# Altium project Project Kraken (The Ultimate ESP32-S3 dev board).PrjPcb (part 5 of 5)

## Sheet DAC.SchDoc
size A3; SheetNumber: 9; SheetTotal: 9
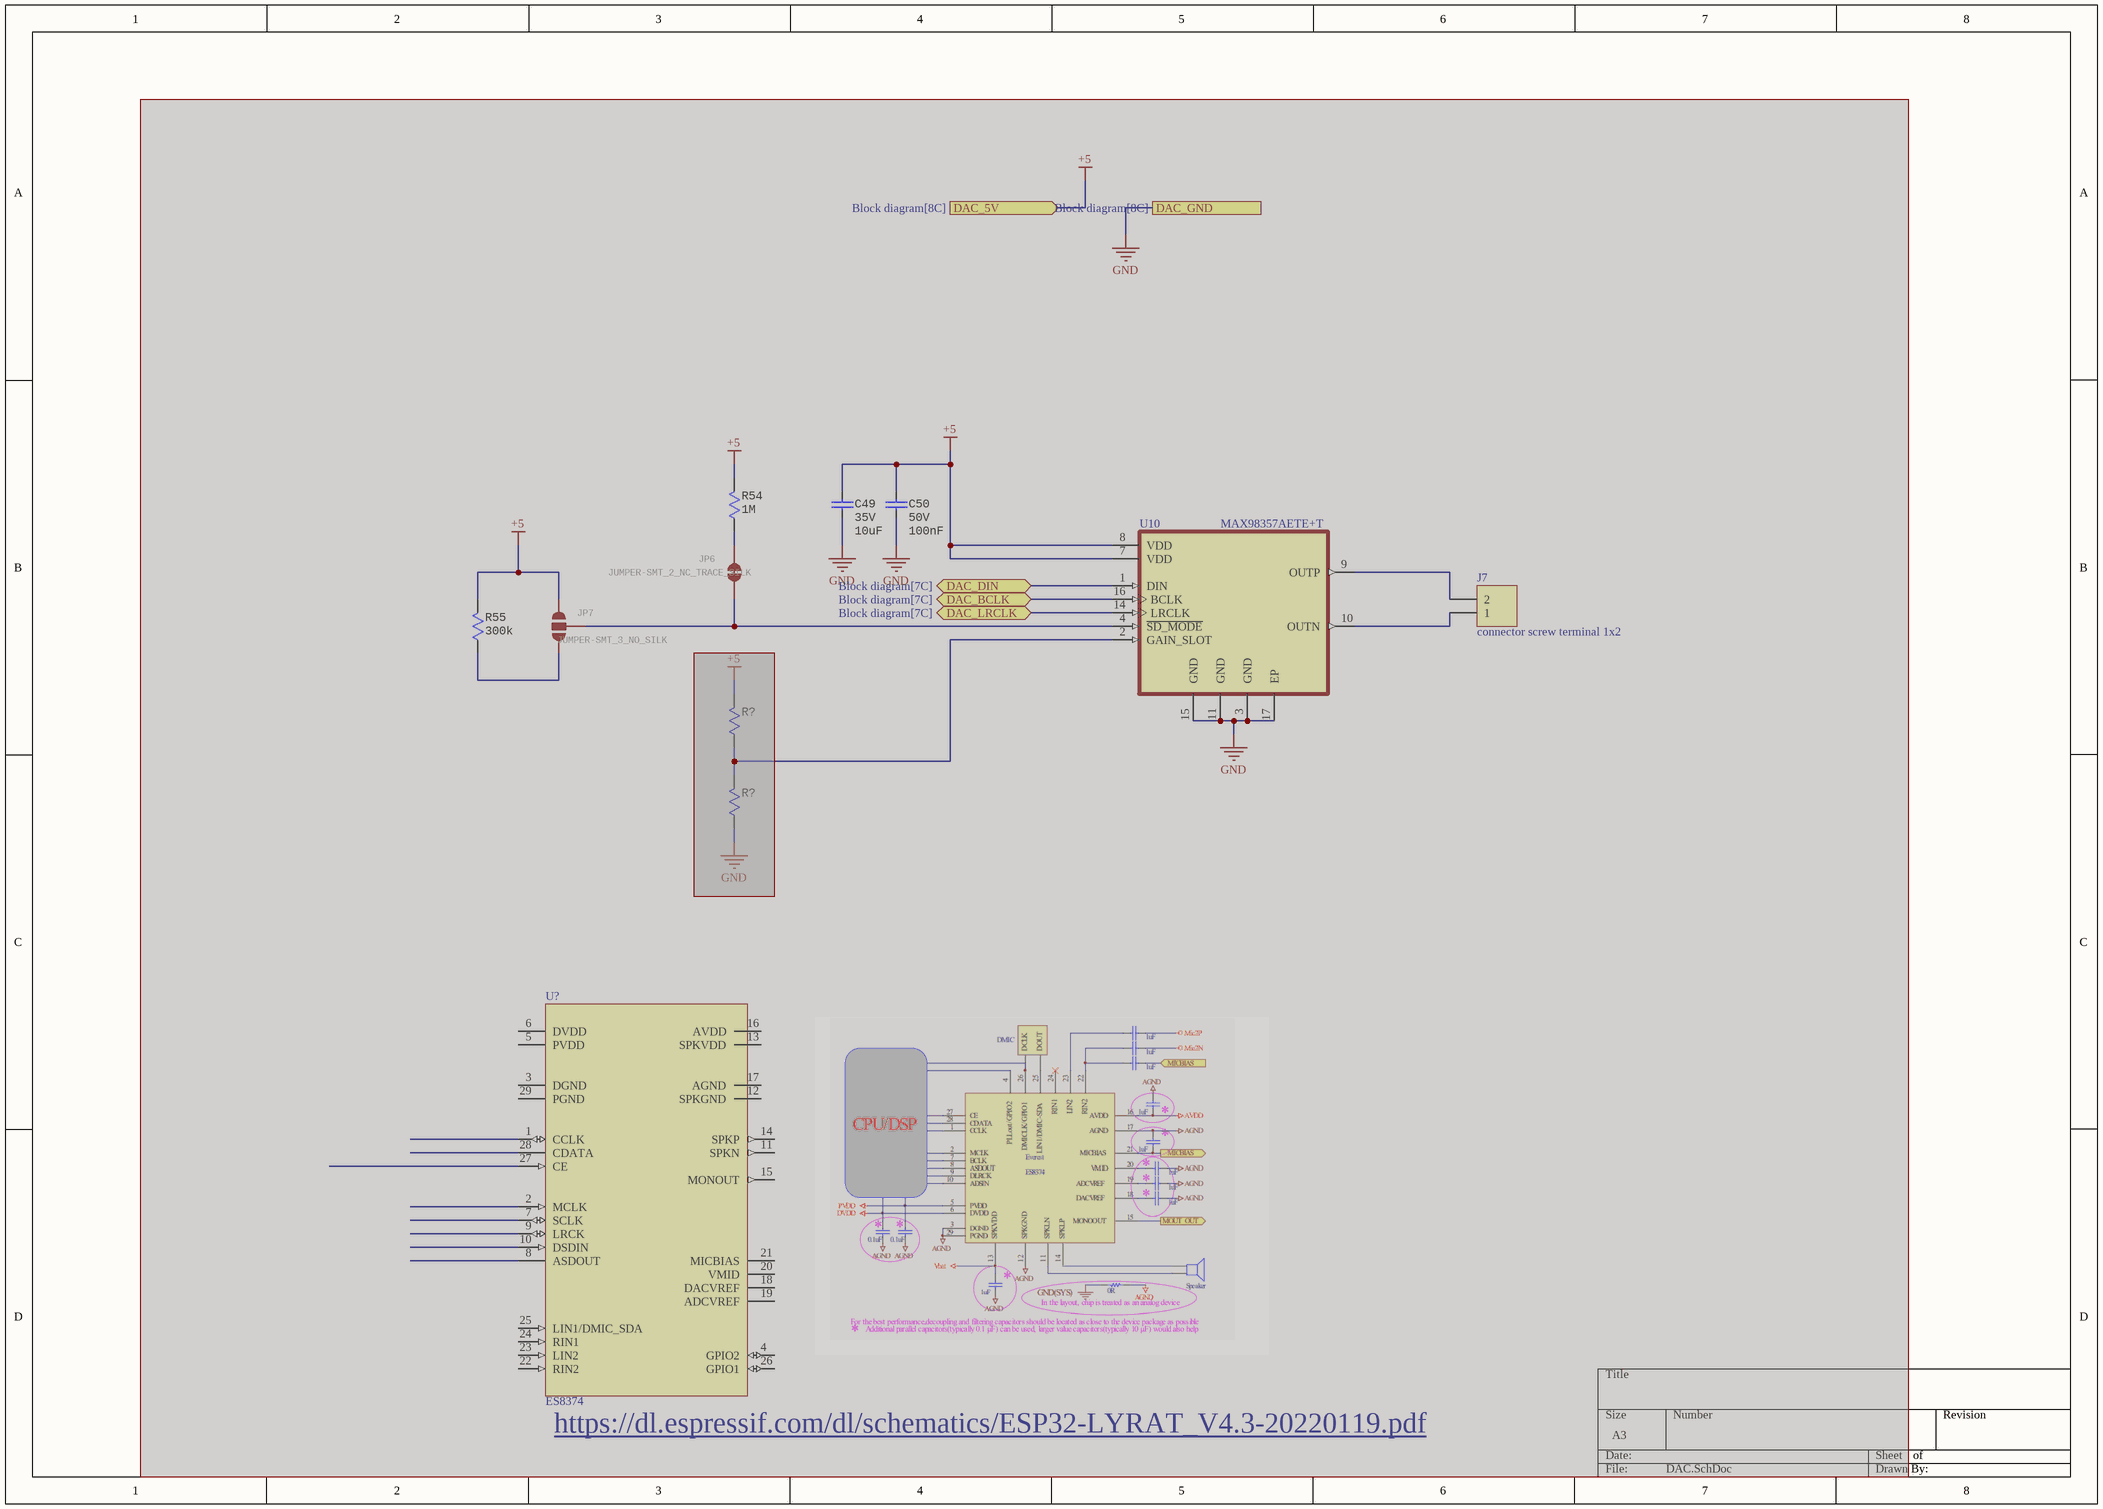
[diagram p8: DAC.SchDoc]

### Parts
(Parts that share a designator on the sheet are numbered #1, #2 ... from top to bottom, then left to right.)
C49  Voltage: 35V  [CAP Ceramic SMD 0603]  (hidden comment: 10uF)  (masked out: inside a compile mask, not in the netlist)
C50  Voltage: 50V  [CAP Ceramic SMD 0603]  (hidden comment: 100nF)  (masked out: inside a compile mask, not in the netlist)
J7  connector screw terminal 1x2  [Connector screw terminal Block TH 1x2 3.5]  (masked out: inside a compile mask, not in the netlist)
JP6  JUMPER-SMT_2_NC_TRACE_SILK  [SMT-JUMPER_2_NC_TRACE_SILK]  (masked out: inside a compile mask, not in the netlist)
JP7  JUMPER-SMT_3_NO_SILK  [SMT-JUMPER_3_NO_SILK]  (masked out: inside a compile mask, not in the netlist)
R54  value 1M  [RES SMD 0603]  (hidden comment: 1MR)  (masked out: inside a compile mask, not in the netlist)
R55  300k  [RES SMD 0603]  (masked out: inside a compile mask, not in the netlist)
R?#1  (no value)  [RES SMD 0603]  (masked out: inside a compile mask, not in the netlist)
R?#2  (no value)  [RES SMD 0603]  (masked out: inside a compile mask, not in the netlist)
U10  MAX98357AETE+T  [QFN50P300X300X80-17N]  (masked out: inside a compile mask, not in the netlist)
U?#2  ES8374  [QFN50P500X500X100-29N]  (masked out: inside a compile mask, not in the netlist)

### Ports
DAC_5V (in, see Block diagram[8C]), DAC_BCLK (bidir, see Block diagram[7C]), DAC_DIN (bidir, see Block diagram[7C]), DAC_GND (see Block diagram[8C]), DAC_LRCLK (bidir, see Block diagram[7C])

### Notes on the sheet
- (near U?#2) https://dl.espressif.com/dl/schematics/ESP32-LYRAT_V4.3-20220119.pdf

### Library data of the parts
C49 = CAP 0603 10uF 35V: Cap Ceramic 10uF 35V X5R 20% Pad SMD 0603 85C T/R; Manufacturer: Murata; Manufacturer Part Number: GRM188R6YA106MA73D; Supplier 1: LCSC; RoHS: Yes; Category: Ceramic Capacitors; Mount: Surface Mount; Case/Package: 0603; Case Code (Metric): 1608; Case Code (Imperial): 0603; Min Operating Temperature: -55°C; Max Operating Temperature: 85°C; Packaging: Tape and Reel; Capacitance: 10uF; Voltage Rating: 35V; Tolerance: 20%; Dielectric: X5R; Voltage Rating (DC): 35V; Length: 0.063inch; Width: 0.031inch; Thickness: 0.039inch; RoHS Compliant: Yes; ComponentLink1URL: http://search.murata.co.jp/Ceramy/image/img/A01X/G101/ENG/GRM188R6YA106MA73-01.pdf?src-supplier=Future+Electronics; ComponentLink1Description: http://search.murata.co.jp/Ceramy/image/img/A01X/G101/ENG/GRM188R6YA106MA73-01.pdf?src-supplier=Future+Electronics; ComponentLink2URL: http://search.murata.co.jp/Ceramy/image/img/A01X/G101/ENG/GRM188R6YA106MA73-01.pdf?src-supplier=Digi-Key; ComponentLink2Description: http://search.murata.co.jp/Ceramy/image/img/A01X/G101/ENG/GRM188R6YA106MA73-01.pdf?src-supplier=Digi-Key; ComponentLink3URL: https://www.murata.com/~/media/webrenewal/support/library/catalog/products/capacitor/mlcc/c02e.ashx?la=en-us&src-supplier=Digi-Key; ComponentLink3Description: https://www.murata.com/~/media/webrenewal/support/library/catalog/products/capacitor/mlcc/c02e.ashx?la=en-us&src-supplier=Digi-Key; ComponentLink4URL: http://search.murata.co.jp/Ceramy/image/img/A01X/G101/ENG/GRM188R6YA106MA73-01.pdf?src-supplier=Mouser; ComponentLink4Description: http://search.murata.co.jp/Ceramy/image/img/A01X/G101/ENG/GRM188R6YA106MA73-01.pdf?src-supplier=Mouser; ComponentLink5URL: http://search.murata.co.jp/Ceramy/image/img/A01X/G101/ENG/GRM188R6YA106MA73-01.pdf?src-supplier=TTI; ComponentLink5Description: http://search.murata.co.jp/Ceramy/image/img/A01X/G101/ENG/GRM188R6YA106MA73-01.pdf?src-supplier=TTI; Supplier Part Number 1: C194427; Value: 10uF
C50 = CAP 0603 100nF 50V: Multilayer Ceramic Capacitors MLCC Surface Mount 0603 0.1uF 50 Volts X7R 10%; Manufacturer: Murata; Manufacturer Part Number: GRM188R71H104KA93D; Insulation Resistance: 10GR; Supplier 1: LCSC; RoHS: Yes; Category: Ceramic Capacitors; Stock 1: 3546650; Pricing 1: 50=0.00420, 500=0.00330, 1500=0.00290, 5000=0.00260, 25000=0.00250, 50000=0.00240 (USD); Mount: Surface Mount; Case/Package: 0603; Number of Pins: 2; Case Code (Imperial): 0603; Case Code (Metric): 1608; Dielectric Material: Ceramic; Material: Ceramic; Contact Plating: Tin,Matte; Min Operating Temperature: -55°C; Max Operating Temperature: 125°C; Capacitance: 100nF; Tolerance: 10%; Packaging: Tape and Reel; Dielectric: X7R; Voltage Rating (DC): 50V; Termination: SMD/SMT; Package Quantity: 1; Voltage Rating: 50V; Length: 1.6mm; Width: 0.8mm; Height: 0.8mm; Depth: 0.8mm; Thickness: 0.035inch; Radiation Hardening: No; RoHS Compliant: Yes; REACH SVHC: No SVHC; Lead Free: Lead Free; ComponentLink1URL: https://datasheet.ciiva.com/19467/1857604-19467681.pdf?src-supplier=Jameco; ComponentLink1Description: https://datasheet.ciiva.com/19467/1857604-19467681.pdf?src-supplier=Jameco; ComponentLink2URL: https://datasheet.ciiva.com/11786/0900766b807a1cab-11786047.pdf?src-supplier=RSComponents; ComponentLink2Description: https://datasheet.ciiva.com/11786/0900766b807a1cab-11786047.pdf?src-supplier=RSComponents; ComponentLink3URL: https://datasheet.ciiva.com/29201/451744-da-01-en-vs-kondensator-0603-29201904.pdf?src-supplier=Conrad; ComponentLink3Description: https://datasheet.ciiva.com/29201/451744-da-01-en-vs-kondensator-0603-29201904.pdf?src-supplier=Conrad; ComponentLink4URL: https://datasheet.ciiva.com/7937/4360-7937659.pdf?src-supplier=Element14; ComponentLink4Description: https://datasheet.ciiva.com/7937/4360-7937659.pdf?src-supplier=Element14; ComponentLink5URL: https://datasheet.ciiva.com/14116/nmgrm-data-en-14116602.pdf?src-supplier=Distrelec; ComponentLink5Description: https://datasheet.ciiva.com/14116/nmgrm-data-en-14116602.pdf?src-supplier=Distrelec; ComponentLink6URL: https://datasheet.ciiva.com/48436/nmgrm-data-en-48436667.pdf?src-supplier=Distrelec; ComponentLink6Description: https://datasheet.ciiva.com/48436/nmgrm-data-en-48436667.pdf?src-supplier=Distrelec; ComponentLink7URL: https://datasheet.ciiva.com/28534/4360-28534245.pdf?src-supplier=Element14; ComponentLink7Description: https://datasheet.ciiva.com/28534/4360-28534245.pdf?src-supplier=Element14; ComponentLink8URL: https://datasheet.ciiva.com/131/partnumbering-e-01-131739.pdf?src-supplier=Digi-Key; ComponentLink8Description: https://datasheet.ciiva.com/131/partnumbering-e-01-131739.pdf?src-supplier=Digi-Key; ComponentLink9URL: https://datasheet.ciiva.com/131/partnumbering-e-01-131738.pdf?src-supplier=Digi-Key; ComponentLink9Description: https://datasheet.ciiva.com/131/partnumbering-e-01-131738.pdf?src-supplier=Digi-Key; ComponentLink10URL: https://datasheet.ciiva.com/131/partnumbering-e-01-131740.pdf?src-supplier=Digi-Key; ComponentLink10Description: https://datasheet.ciiva.com/131/partnumbering-e-01-131740.pdf?src-supplier=Digi-Key; ComponentLink11URL: https://datasheet.ciiva.com/7937/1747470-7937658.pdf?src-supplier=Element14; ComponentLink11Description: https://datasheet.ciiva.com/7937/1747470-7937658.pdf?src-supplier=Element14; Supplier Part Number 1: C77055; Value: 100nF
J7 = connector screw terminal 1x2: 691214110002 - Wire-To-Board Terminal Block, 3.5 mm, 2 Positions, 24 AWG, 16 AWG, 1.5 mm², Screw; Manufacturer: Wurth Electronics; Plating: Brass,Steel; Number of Levels: 1; Number of Positions Per Level: 2; Current: 10A; Voltage: 300V; Wire Gauge (Max): 24AWG; Wire Gauge (Min): 16AWG; Pitch: 0.138inch; Stripping Length: -6mm; Supplier 1: Digi-Key; Manufacturer Part Number: 691214110002; RoHS: Yes; Category: Terminal Blocks; Stock 1: 5949; Pricing 1: 1=0.83000, 10=0.73900, 50=0.63800, 100=0.57100, 500=0.53800, 1400=0.50400 (USD); Mount: Through Hole; Color: Blue,Green; Housing Material: PA66; Contact Material: Brass; Contact Plating: Brass,Tin; Min Operating Temperature: -40°C; Max Operating Temperature: 105°C; Packaging: Bulk; Termination: Screw; Package Quantity: 1400; Number of Contacts: 2; Series: WR-TBL Series 2141; Voltage Rating: 300V; Current Rating: 10A; Length: 7.4mm; Width: 7.9mm; Height: 12.2mm; Wire/Cable Gauge: 24AWG; REACH SVHC: Unknown; RoHS Compliant: Yes; ComponentLink1URL: https://datasheet.ciiva.com/824/6912141100xx-824001.pdf?src-supplier=Digi-Key; ComponentLink1Description: https://datasheet.ciiva.com/824/6912141100xx-824001.pdf?src-supplier=Digi-Key; ComponentLink2URL: https://datasheet.ciiva.com/48693/001088618-da-01-en-wr-tbl-terminal-block2141-691214110002-48693195.pdf?src-supplier=Conrad; ComponentLink2Description: https://datasheet.ciiva.com/48693/001088618-da-01-en-wr-tbl-terminal-block2141-691214110002-48693195.pdf?src-supplier=Conrad; Supplier Part Number 1: 732-2747-ND
JP6 = JUMPER-SMT_2_NC_TRACE_SILK: Normally closed trace jumper    This jumper has a trace between two pads so it's normally closed (NC). Use a razor knife to open the connection. For best results follow the IPC guidelines for cutting traces: Cutout at least 0.063 mm (0.005 in).  Remove all loose material to clean up the cut area.  Seal the cut with an approved epoxy.       Reapply solder to reclose the connection.; GateName_1: G$1; SymbolName_1: SMT-JUMPER_2_NC_TRACE; DeviceName: _SILK; LibraryName: SparkFun-Jumpers; DeviceSetName: JUMPER-SMT_2_NC_TRACE; Package: SMT-JUMPER_2_NC_TRACE_SILK
JP7 = JUMPER-SMT_3_NO_SILK: Normally open jumper    This jumper has three pads in close proximity to each other. Apply solder to close the connection(s).; GateName_1: G$1; SymbolName_1: SMT-JUMPER_3_NO; DeviceName: _SILK; LibraryName: SparkFun-Jumpers; DeviceSetName: JUMPER-SMT_3_NO; Package: SMT-JUMPER_3_NO_SILK
R54 = RES 0603 1M 1%: Res Thick Film 0603 1M Ohm 1% 1/10W ±100ppm/°C Molded SMD Punched Carrier T/R; Manufacturer: Vishay; Manufacturer Part Number: CRCW06031M00FKEA; Max Power Dissipation: 100mW; Voltage Rating (DC): 75V; Supplier 1: RSComponents; RoHS: Yes; Category: Chip SMD Resistors; Stock 1: 1700; Pricing 1: 50=0.05900, 500=0.05400, 1000=0.04900, 2000=0.04400, 4000=0.03800 (GBP); Mount: Surface Mount; Case/Package: 0603; Number of Pins: 2; Case Code (Imperial): 0603; Case Code (Metric): 1608; Contact Plating: Tin; Size Code: 0603; Weight: 7.1E-05oz; Min Operating Temperature: -55°C; Max Operating Temperature: 155°C; Tolerance: 1%; Packaging: Tape and Reel; Resistance: 1MR; Resistor Type: Thick Film; Number of Terminations: 2; Temperature Coefficient: 100ppm/°C; Series: CRCW; Package Quantity: 10; Power Rating: 100mW; Features: Automotive AEC-Q200; Voltage Rating: 75V; Construction: Rectangular; Termination: SMD/SMT; Resistance Tolerance: 1%; Technology: THICK FILM; Length: 1.55mm; Width: 0.85mm; Height: 0.45mm; Depth: 0.85mm; Radiation Hardening: No; RoHS Compliant: Yes; Lead Free: Lead Free; Military Standard: Not; REACH SVHC: Unknown; ComponentLink1URL: https://datasheet.ciiva.com/11809/0900766b80d98afc-11809074.pdf?src-supplier=RSComponents; ComponentLink1Description: https://datasheet.ciiva.com/11809/0900766b80d98afc-11809074.pdf?src-supplier=RSComponents; ComponentLink2URL: https://datasheet.ciiva.com/26314/fld-crcw-e3-data-en-26314645.pdf?src-supplier=Distrelec; ComponentLink2Description: https://datasheet.ciiva.com/26314/fld-crcw-e3-data-en-26314645.pdf?src-supplier=Distrelec; ComponentLink3URL: https://datasheet.ciiva.com/2465/dcrcwe3-2465549.pdf?src-supplier=Digi-Key; ComponentLink3Description: https://datasheet.ciiva.com/2465/dcrcwe3-2465549.pdf?src-supplier=Digi-Key; ComponentLink4URL: https://datasheet.ciiva.com/16311/dcrcwe3-16311533.pdf?src-supplier=Future+Electronics; ComponentLink4Description: https://datasheet.ciiva.com/16311/dcrcwe3-16311533.pdf?src-supplier=Future+Electronics; ComponentLink5URL: https://datasheet.ciiva.com/2465/dcrcwe3-2465550.pdf?src-supplier=Digi-Key; ComponentLink5Description: https://datasheet.ciiva.com/2465/dcrcwe3-2465550.pdf?src-supplier=Digi-Key; ComponentLink6URL: https://datasheet.ciiva.com/7841/1720486-7841822.pdf?src-supplier=Element14; ComponentLink6Description: https://datasheet.ciiva.com/7841/1720486-7841822.pdf?src-supplier=Element14; ComponentLink7URL: https://datasheet.ciiva.com/2465/dcrcwe3-2465551.pdf?src-supplier=Digi-Key; ComponentLink7Description: https://datasheet.ciiva.com/2465/dcrcwe3-2465551.pdf?src-supplier=Digi-Key; ComponentLink8URL: https://datasheet.ciiva.com/7841/125364-7841823.pdf?src-supplier=Element14; ComponentLink8Description: https://datasheet.ciiva.com/7841/125364-7841823.pdf?src-supplier=Element14; Supplier Part Number 1: 6789932; Supplier 2: LCSC; Stock 2: 440800; Pricing 2: 50=0.009700, 500=0.007800, 1500=0.006700, 5000=0.006100, 25000=0.005500, 50000=0.005200 (AUD); ComponentLink9URL: https://datasheet.ciiva.com/2432/aoa0000c304-2432473.pdf?src-supplier=Digi-Key; ComponentLink9Description: https://datasheet.ciiva.com/2432/aoa0000c304-2432473.pdf?src-supplier=Digi-Key; Supplier Part Number 2: C193390
R55 = RES 0603 300k 1%: Res Thick Film 0603 300K Ohm 1% 0.1W(1/10W) ±100ppm/C Pad SMD T/R; Manufacturer: Yageo; Manufacturer Part Number: RC0603FR-07300KL; Power Rating: 100mW; Temperature Coefficient: 100ppm/°C; Voltage Rating (DC): 50V; Supplier 1: LCSC; Supplier Part Number 1: C114667; RoHS: Yes; Category: Chip SMD Resistors; Stock 1: 283249; Pricing 1: 1=0.10000, 10=0.02100, 100=0.00850, 1000=0.00383, 2500=0.00332 (USD); Mount: Surface Mount; Case/Package: 0603; Case Code (Metric): 1608; Case Code (Imperial): 0603; Size Code: 0603; Min Operating Temperature: -55°C; Max Operating Temperature: 155°C; Tolerance: 1%; Packaging: Tape and Reel; Package Quantity: 1; Voltage Rating: 50V; Resistor Type: Thick Film; Number of Terminations: 2; Termination: SMD/SMT; Max Power Dissipation: 100mW; Features: Moisture Resistant; Series: RC; Construction: Rectangular; Length: 0.063inch; Width: 0.031inch; Height: 0.022inch; Depth: 0.8mm; Lead Free: Lead Free; Military Standard: Not; RoHS Compliant: Yes; ComponentLink1URL: https://datasheet.ciiva.com/2454/pyu-r-int-thick-7-2454475.pdf?src-supplier=Digi-Key; ComponentLink1Description: https://datasheet.ciiva.com/2454/pyu-r-int-thick-7-2454475.pdf?src-supplier=Digi-Key; ComponentLink2URL: https://datasheet.ciiva.com/2454/pyu-r-int-thick-7-2454476.pdf?src-supplier=Digi-Key; ComponentLink2Description: https://datasheet.ciiva.com/2454/pyu-r-int-thick-7-2454476.pdf?src-supplier=Digi-Key; ComponentLink3URL: https://datasheet.ciiva.com/2454/pyu-r-int-thick-7-2454474.pdf?src-supplier=Digi-Key; ComponentLink3Description: https://datasheet.ciiva.com/2454/pyu-r-int-thick-7-2454474.pdf?src-supplier=Digi-Key; ComponentLink4URL: https://datasheet.ciiva.com/15189/getdatasheetpartid-348071-15189692.pdf?src-supplier=Verical; ComponentLink4Description: https://datasheet.ciiva.com/15189/getdatasheetpartid-348071-15189692.pdf?src-supplier=Verical; Resistance: 300k
R?#1 R?#2 = RES 0603  1%
U10 = MAX98357AETE+T: IC AUDIO AMP CLASS D 16-TQFN; Manufacturer: Maxim; Max Output Power: 3.2W; Voltage Gain: 15dB; Min Supply Voltage: 2.5V; Max Supply Voltage: 5.5V; Power Supply Rejection Ratio (PSRR): 77dB; Max Power Dissipation: 1.666W; Max Output Current: 1.6A; Supplier 1: LCSC; Supplier Part Number 1: C910544; Manufacturer Part Number: MAX98357AETE+T; RoHS: Yes; Category: Amplifiers - Audio; Stock 1: 6349; Pricing 1: 1=1.14870, 10=1.02460, 30=0.90690, 100=0.81940, 500=0.78280, 1000=0.76530 (USD); Mount: Surface Mount; Number of Pins: 16; Contact Plating: Tin,Matte; Min Operating Temperature: -40°C; Max Operating Temperature: 85°C; Packaging: Tape and Reel; Radiation Hardening: No; RoHS Compliant: Yes; ComponentLink1URL: https://datasheet.ciiva.com/29970/max98357a-max98357b-29970280.pdf?src-supplier=Avnet; ComponentLink1Description: https://datasheet.ciiva.com/29970/max98357a-max98357b-29970280.pdf?src-supplier=Avnet
U?#2 = ES8374: Manufacturer: Everest-semi(Everest Semiconductor); ComponentLink1Description: New link; ComponentLink1URL: https://datasheet.lcsc.com/lcsc/1912111437_Everest-semi-Everest-Semiconductor-ES8374_C365738.pdf; ManufacturerPartNumber: ES8374; Supplier: LCSC; SupplierPartNumber: C365738

## Nets that join several sheets
+1V5: Block diagram (P?#1.2), Camera module (C26.1 C27.1 P1.10), Power section (C22.1 C23.1 U6.5)
+2V8: Block diagram (P?#1.3), Camera module (6 pins), Power section (C11.1 C12.1 U4.5)
+3V3: Block diagram (6 pins), USB intrface (C7.1 C8.1 U3.10), Camera module (R23.2 R24.2 R25.2), ESP32-S3 (R7.2 R9.2 U2.2), Power section (11 pins), Ethernet (9 pins), USB to UART0 interface (C4.1 R1.2 R2.2 U1.16)
+5: Block diagram (P?#1.5 P?#3.5), USB intrface (D7.2 F3.1), Power section (C?#1.1 C?#2.1 U?#1.3), CAN (5 pins), USB to UART0 interface (D1.2)
GND: Block diagram (8 pins), USB intrface (16 pins), Camera module (9 pins), ESP32-S3 (15 pins), Power section (15 pins), Ethernet (27 pins), CAN (7 pins), USB to UART0 interface (12 pins)
CAN_n: Block diagram (P?#4.2), CAN (D14.1 J6.1 R53.2 U9.6)
CAN_p: Block diagram (P?#4.3), CAN (D14.2 J5.1 J6.2 U9.7)
CAN_RX: ESP32-S3 (U2.7), CAN (JP5.3)
CAN_TX: ESP32-S3 (U2.12), CAN (JP4.3)
CH340_Rx_ESP32_Tx: Block diagram (P4.3), ESP32-S3 (U2.37), USB to UART0 interface (D3.2 U1.3)
CH340_Tx_ESP32_Rx: Block diagram (P4.2), ESP32-S3 (U2.36), USB to UART0 interface (D2.2 U1.2)
DVP_HREF: Camera module (P1.9), ESP32-S3 (U2.31)
DVP_PCLK: Camera module (P1.17), ESP32-S3 (U2.19)
DVP_VSYNC: Camera module (P1.7), ESP32-S3 (U2.23)
DVP_XCLK: Camera module (P1.13), ESP32-S3 (U2.33)
DVP_Y2: Camera module (P1.19), ESP32-S3 (U2.21)
DVP_Y3: Camera module (P1.21), ESP32-S3 (U2.24)
DVP_Y4: Camera module (P1.22), ESP32-S3 (U2.22)
DVP_Y5: Camera module (P1.20), ESP32-S3 (U2.15)
DVP_Y6: Camera module (P1.18), ESP32-S3 (U2.20)
DVP_Y7: Camera module (P1.16), ESP32-S3 (U2.35)
DVP_Y8: Camera module (P1.14), ESP32-S3 (U2.34)
DVP_Y9: Camera module (P1.12), ESP32-S3 (U2.32)
EN: ESP32-S3 (C6.2 R9.1 R10.1 U2.3), USB to UART0 interface (Q1.3)
ESP32_USB_n: USB intrface (U3.6), ESP32-S3 (U2.13)
ESP32_USB_p: USB intrface (U3.4), ESP32-S3 (U2.14)
ETH_CS: ESP32-S3 (U2.26), Ethernet (U7.32)
ETH_~{INT}: ESP32-S3 (U2.4), Ethernet (U7.36)
ETH_MISO: Block diagram (P3.3), ESP32-S3 (U2.28), Ethernet (U7.34), CAN (U8.15)
ETH_MOSI: Block diagram (P3.4), ESP32-S3 (U2.30), Ethernet (U7.35), CAN (U8.14)
ETH_~{RST}: ESP32-S3 (U2.5), Ethernet (U7.37)
ETH_SCLK: Block diagram (P3.2), ESP32-S3 (U2.29), Ethernet (U7.33), CAN (U8.13)
I2C_SCL: Block diagram (P2.2), Camera module (P1.5 R24.1), ESP32-S3 (U2.11)
I2C_SDA: Block diagram (P2.3), Camera module (P1.3 R23.1), ESP32-S3 (U2.10)
IO0: Block diagram (P?#2.1), ESP32-S3 (U2.39)
IO0: ESP32-S3 (C5.2 R7.1 R8.1 U2.27), USB to UART0 interface (Q2.3)
IO2: Block diagram (P?#2.2), ESP32-S3 (U2.38)
IO6: Block diagram (P?#2.3), ESP32-S3 (U2.6)
IO9: Block diagram (P?#2.4), ESP32-S3 (U2.17)
IO10: Block diagram (P?#2.5), ESP32-S3 (U2.18)
IO15: Block diagram (P?#2.6), ESP32-S3 (U2.8)
IO16: Block diagram (P?#2.7), ESP32-S3 (U2.9)
IO46: ESP32-S3 (U2.16), CAN (U8.16)
IO48: Block diagram (P?#2.8), ESP32-S3 (U2.25)